# EAGLE design 32u4_devboard_v10 (EAGLE 6.6.0)
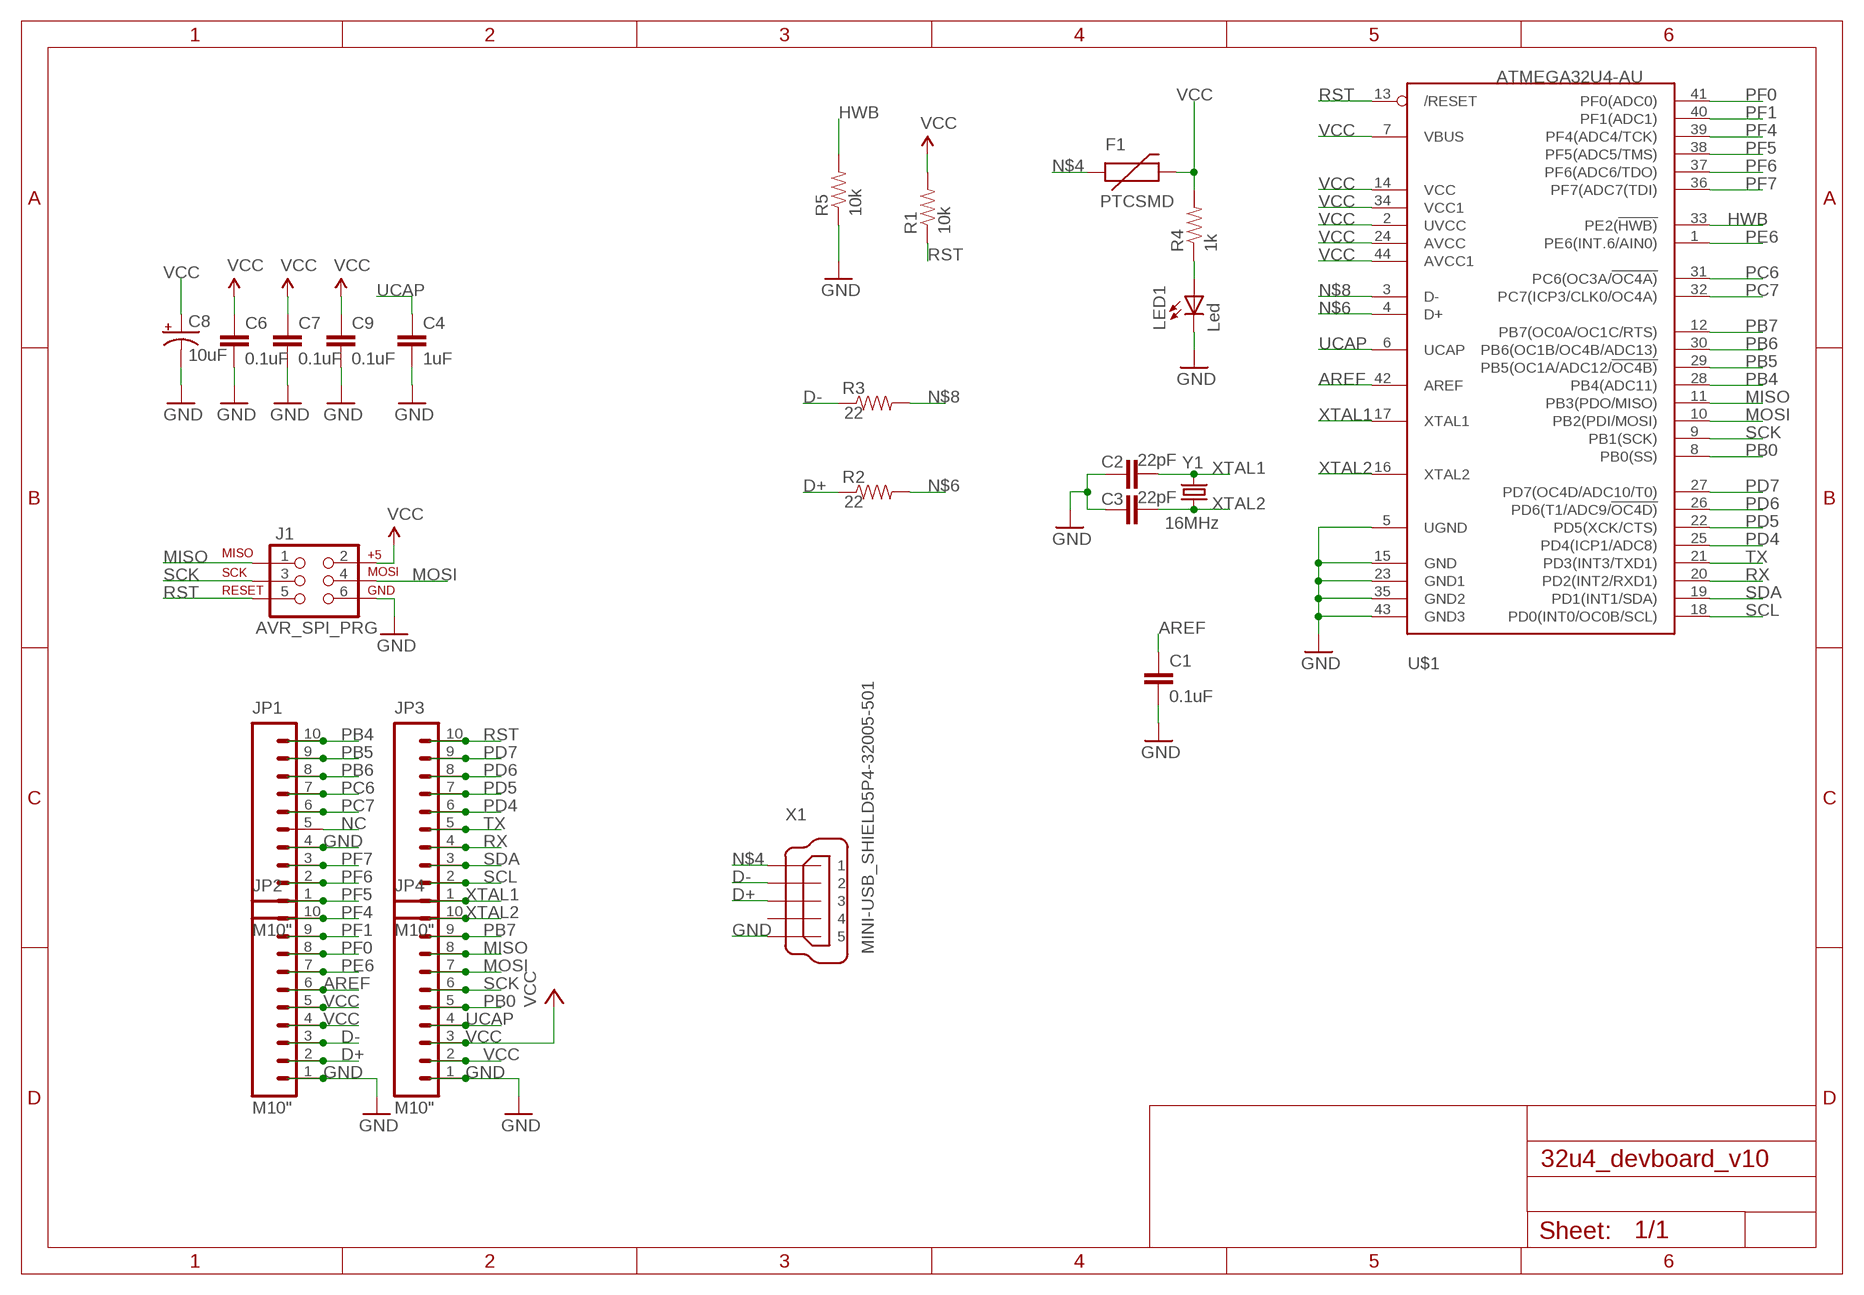
[diagram p0: schematic, sheet 1]

## Parts
C1  0.1uF  CAP0805  [0805]
C2  22pF  CAP0603-CAP  [0603-CAP]
C3  22pF  CAP0603-CAP  [0603-CAP]
C4  1uF  CAP0805  [0805]
C6  0.1uF  CAP0805  [0805]
C7  0.1uF  CAP0805  [0805]
C8  10uF  CAP_POL1206  [EIA3216]
C9  0.1uF  CAP0805  [0805]
F1  PTCSMD  [PTC-1206]
J1  AVR_SPI_PRG  AVR_SPI_PRG_6PTH  [2X3]
JP1  M10"  [1X10]
JP2  M10"  [1X10]
JP3  M10"  [1X10]
JP4  M10"  [1X10]
LED1  Led  LEDCHIP-LED0805  [CHIP-LED0805]
R1  10k  RESISTOR0805-RES  [0805]
R2  22  RESISTOR0805-RES  [0805]
R3  22  RESISTOR0805-RES  [0805]
R4  1k  RESISTOR0805-RES  [0805]
R5  10k  RESISTOR0805-RES  [0805]
U$1  ATMEGA32U4-AU  [TQFP44]
X1  MINI-USB_SHIELD5P4-32005-501  [32005-501]
Y1  16MHz  CRYSTALHC49US  [HC49US]

## Nets
AREF: C1.1 JP2.6 U$1.42(AREF)
D+: JP2.2 R2.1 X1.3
D-: JP2.3 R3.1 X1.2
GND: C1.2 C2.1 C3.1 C4.2 C6.2 C7.2 C8.C(-) C9.2 J1.6 JP1.4 JP2.1 JP4.1 LED1.C R5.1 U$1.5(UGND) U$1.15(GND) U$1.23(GND1) U$1.35(GND2) U$1.43(GND3) X1.5
HWB: R5.2 U$1.33(PE2(!HWB))
MISO: J1.1 JP4.8 U$1.11(PB3(PDO/MISO))
MOSI: J1.4 JP4.7 U$1.10(PB2(PDI/MOSI))
N$4: F1.1 X1.1
N$6: R2.2 U$1.4(D+)
N$8: R3.2 U$1.3(D-)
N$9: LED1.A R4.1
NC: JP1.5
PB0: JP4.5 U$1.8(PB0(SS))
PB4: JP1.10 U$1.28(PB4(ADC11))
PB5: JP1.9 U$1.29(PB5(OC1A/ADC12/!OC4B))
PB6: JP1.8 U$1.30(PB6(OC1B/OC4B/ADC13))
PB7: JP4.9 U$1.12(PB7(OC0A/OC1C/RTS))
PC6: JP1.7 U$1.31(PC6(OC3A/!OC4A))
PC7: JP1.6 U$1.32(PC7(ICP3/CLK0/OC4A))
PD4: JP3.6 U$1.25(PD4(ICP1/ADC8))
PD5: JP3.7 U$1.22(PD5(XCK/CTS))
PD6: JP3.8 U$1.26(PD6(T1/ADC9/!OC4D))
PD7: JP3.9 U$1.27(PD7(OC4D/ADC10/T0))
PE6: JP2.7 U$1.1(PE6(INT.6/AIN0))
PF0: JP2.8 U$1.41(PF0(ADC0))
PF1: JP2.9 U$1.40(PF1(ADC1))
PF4: JP2.10 U$1.39(PF4(ADC4/TCK))
PF5: JP1.1 U$1.38(PF5(ADC5/TMS))
PF6: JP1.2 U$1.37(PF6(ADC6/TDO))
PF7: JP1.3 U$1.36(PF7(ADC7(TDI))
RST: J1.5 JP3.10 R1.1 U$1.13(/RESET)
RX: JP3.4 U$1.20(PD2(INT2/RXD1))
SCK: J1.3 JP4.6 U$1.9(PB1(SCK))
SCL: JP3.2 U$1.18(PD0(INT0/OC0B/SCL))
SDA: JP3.3 U$1.19(PD1(INT1/SDA))
TX: JP3.5 U$1.21(PD3(INT3/TXD1))
UCAP: C4.1 JP4.4 U$1.6(UCAP)
VCC: C6.1 C7.1 C8.A(+) C9.1 F1.2 J1.2 JP2.4 JP2.5 JP4.2 JP4.3 R1.2 R4.2 U$1.2(UVCC) U$1.7(VBUS) U$1.14(VCC) U$1.24(AVCC) U$1.34(VCC1) U$1.44(AVCC1)
XTAL1: C2.2 JP3.1 U$1.17(XTAL1) Y1.2
XTAL2: C3.2 JP4.10 U$1.16(XTAL2) Y1.1
Unconnected: X1.4 X1.M1(S1) X1.M2(S2) X1.M3(S3) X1.M4(S4)

## Library data of the parts
C1-C4 C6 C7 C9 = SparkFun:CAP: Capacitor Standard 0603 ceramic capacitor, and 0.1" leaded capacitor.
C8 = SparkFun:CAP_POL: Capacitor Polarized These are standard SMD and PTH capacitors. Normally 10uF, 47uF, and 100uF in electrolytic and tantalum varieties. Always verify the external diameter of the through hole cap, it varies with capacity, voltage, and manufacturer. The EIA devices should be standard.
F1 = SparkFun:PTC: Resettable Fuse PTC Resettable Fuse. Spark Fun Electronics SKU : COM-08357
J1 = SparkFun:AVR_SPI_PRG_6: AVR ISP 6 Pin This is the reduced ISP connector for AVR programming. Common on Arduino. This footprint will take up less PCB space and can be used with a 10-pin to 6-pin adapter such as SKU: BOB-08508
JP1-JP4 = SparkFun:M10: Header 10 Standard 10-pin 0.1" header. Use with straight break away headers (SKU : PRT-00116), right angle break away headers (PRT-00553), swiss pins (PRT-00743), machine pins (PRT-00117), and female headers (PRT-00115).
LED1 = led:LED: LED OSRAM: - CHIPLED LG R971, LG N971, LY N971, LG Q971, LY Q971, LO R971, LY R971 LH N974, LH R974 LS Q976, LO Q976, LY Q976 LO Q996 - Hyper CHIPLED LW Q18S LB Q993, LB Q99A, LB R99A - SideLED LS A670, LO A670, LY A670, LG A670, LP A670 LB A673, LV A673, LT A673, LW A673 LH A674 LY A675 LS A676, LA A676, LO A676, LY A676, LW A676 LS A679, LY A679, LG A679 - Hyper Micro SIDELED® LS Y876, LA Y876, LO Y876, LY Y876 LT Y87S - SmartLED LW L88C, LW L88S LB L89C, LB L89S, LG L890 LS L89K, LO L89K, LY L89K LS L896, LA L896, LO L896, LY L896 - TOPLED LS T670, LO T670, LY T670, LG T670, LP T670 LSG T670, LSP T670, LSY T670, LOP T670, LYG T670 LG T671, LOG T671, LSG T671 LB T673, LV T673, LT T673, LW T673 LH T674 LS T676, LA T676, LO T676, LY T676, LB T676, LH T676, LSB T676, LW T676 LB T67C, LV T67C, LT T67C, LS T67K, LO T67K, LY T67K, LW E67C LS E67B, LA E67B, LO E67B, LY E67B, LB E67C, LV E67C, LT E67C LW T67C LS T679, LY T679, LG T679 LS T770, LO T770, LY T770, LG T770, LP T770 LB T773, LV T773, LT T773, LW T773 LH T774 LS E675, LA E675, LY E675, LS T675 LS T776, LA T776, LO T776, LY T776, LB T776 LHGB T686 LT T68C, LB T68C - Hyper Mini TOPLED® LB M676 - Mini TOPLED Santana® LG M470 LS M47K, LO M47K, LY M47K Source: http://www.osram.convergy.de LUXEON: - LUMILED® LXK2-PW12-R00, LXK2-PW12-S00, LXK2-PW14-U00, LXK2-PW14-V00 LXK2-PM12-R00, LXK2-PM12-S00, LXK2-PM14-U00 LXK2-PE12-Q00, LXK2-PE12-R00, LXK2-PE12-S00, LXK2-PE14-T00, LXK2-PE14-U00 LXK2-PB12-K00, LXK2-PB12-L00, LXK2-PB12-M00, LXK2-PB14-N00, LXK2-PB14-P00, LXK2-PB14-Q00 LXK2-PR12-L00, LXK2-PR12-M00, LXK2-PR14-Q00, LXK2-PR14-R00 LXK2-PD12-Q00, LXK2-PD12-R00, LXK2-PD12-S00 LXK2-PH12-R00, LXK2-PH12-S00 LXK2-PL12-P00, LXK2-PL12-Q00, LXK2-PL12-R00 Source: www.luxeon.com KINGBRIGHT: KA-3528ASYC Source: www.kingbright.com
R1-R5 = SparkFun:RESISTOR: Resistor Basic schematic elements and footprints for 0603, 1206, and PTH resistors.
U$1 = adafruit:ATMEGA32U4: http://www.ladyada.net/library/eagle
X1 = con-cypressindustries:MINI-USB_SHIELD5P4-: MINI USB-B R/A W/O POST 5 pol. Source: www.cypressindustries.com; OC_FARNELL: unknown; OC_NEWARK: unknown
Y1 = SparkFun:CRYSTAL: Crystals Various standard crystals. Proven footprints. Spark Fun Electronics SKU : COM-00534

## Board
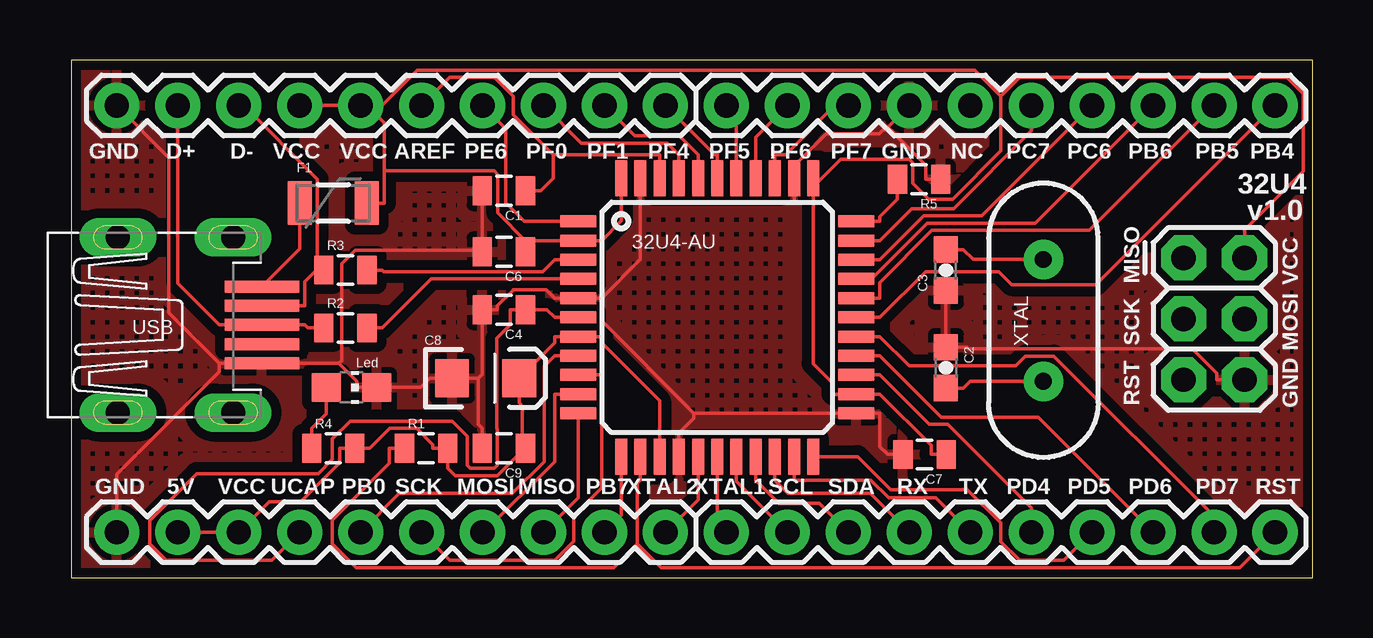
[diagram p1: board, top side]
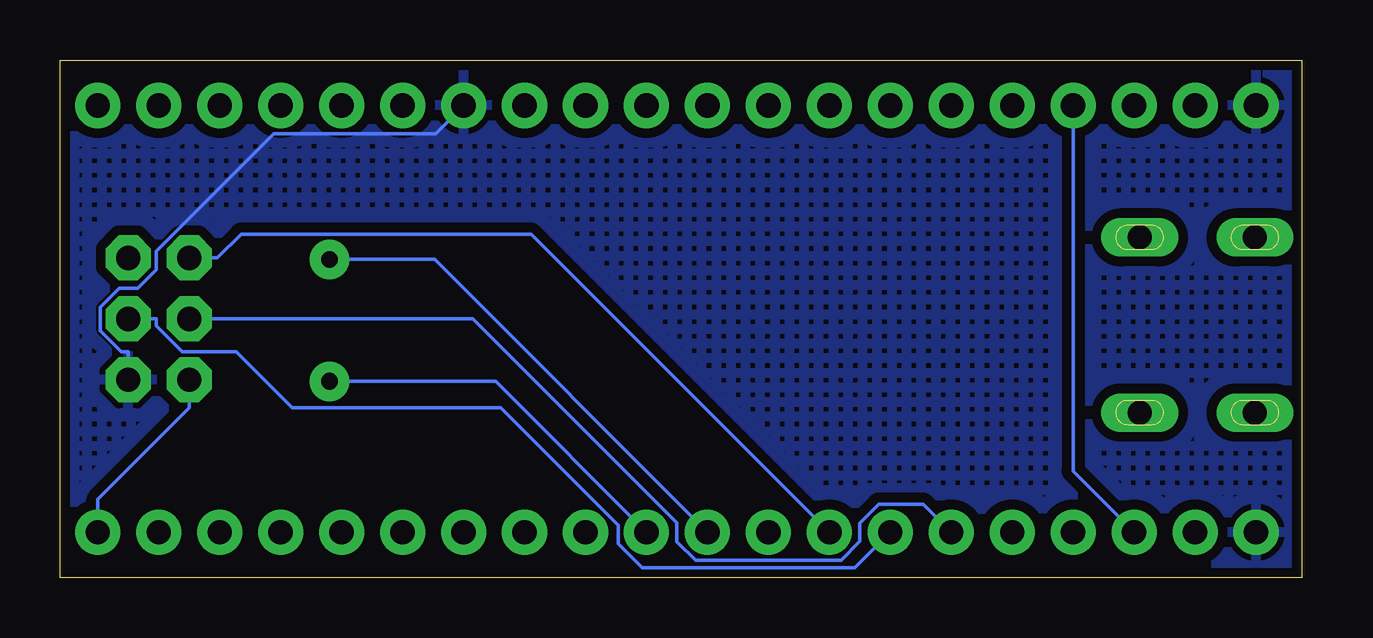
[diagram p2: board, bottom side, seen from below]

Size 51.74 x 21.58 mm. Coordinates in mm from the lower left corner, seen from the top.
Outline: 0,0 51.74,0 51.74,21.58 0,21.58 0,0
Copper layers (1*16): Top 0.035mm / dielectric 1.5mm / Bottom 0.035mm
Design rules "DFRobot_Eagle_Rule_v0.4": minimum track width 6mil, minimum drill 12mil, track to track 6mil, track to pad 6mil, pad to pad 6mil, via to via 6mil, smd to smd 0mil, copper to edge 10mil, drill to drill 10mil, minimum pad ring 12mil, minimum via ring 8mil, stop-mask expansion 2mil, vias tented up to drill 25mil, thermal gap 10mil

### Footprints (pad centres in the part's own frame; a part is rotated, then mirrored left to right if it is on the bottom)
0805 = smd 0.8 x 1.2: 1 -0.9,0; 2 0.9,0
0603-CAP = smd 1.1 x 1: 1 -0.85,0; 2 0.85,0
EIA3216 = smd 1.4 x 1.6: A 1.4,0; C -1.4,0
PTC-1206 = smd 1 x 1.8: 1 -1.4,0; 2 1.4,0
2X3 = drill 1.016 pad 1.88 octagon: 1 0,0; 2 0,2.54; 3 2.54,0; 4 2.54,2.54; 5 5.08,0; 6 5.08,2.54
1X10 = drill 1.016 pad 1.88: 1 0,0; 2 2.54,0; 3 5.08,0; 4 7.62,0; 5 10.16,0; 6 12.7,0; 7 15.24,0; 8 17.78,0; 9 20.32,0; 10 22.86,0
CHIP-LED0805 = smd 1.2 x 1.2: A 0,-1.05; C 0,1.05
TQFP44 = smd 1.5 x 0.5: 1 -5.8,4; 2 -5.8,3.2; 3 -5.8,2.4; 4 -5.8,1.6; 5 -5.8,0.8; 6 -5.8,0; 7 -5.8,-0.8; 8 -5.8,-1.6; 9 -5.8,-2.4; 10 -5.8,-3.2; 11 -5.8,-4; 23 5.8,-4; 24 5.8,-3.2; 25 5.8,-2.4; 26 5.8,-1.6; 27 5.8,-0.8; 28 5.8,0; 29 5.8,0.8; 30 5.8,1.6; 31 5.8,2.4; 32 5.8,3.2; 33 5.8,4 | smd 0.5 x 1.5: 12 -4,-5.8; 13 -3.2,-5.8; 14 -2.4,-5.8; 15 -1.6,-5.8; 16 -0.8,-5.8; 17 0,-5.8; 18 0.8,-5.8; 19 1.6,-5.8; 20 2.4,-5.8; 21 3.2,-5.8; 22 4,-5.8; 34 4,5.8; 35 3.2,5.8; 36 2.4,5.8; 37 1.6,5.8; 38 0.8,5.8; 39 0,5.8; 40 -0.8,5.8; 41 -1.6,5.8; 42 -2.4,5.8; 43 -3.2,5.8; 44 -4,5.8
32005-501 = smd 3.1 x 0.5: 1 3,1.6; 2 3,0.8; 3 3,0; 4 3,-0.8; 5 3,-1.6 | drill 1 pad 1.422 long: M1 -3,3.65; M2 -3,-3.65; M3 1.8,3.65; M4 1.8,-3.65
HC49US = drill 0.7 pad 1.651: 1 -2.54,0; 2 2.54,0

### Placement (x,y rotation side)
C1  18.03,16.13 180 top
C2  36.45,8.76 270 top
C3  36.45,12.83 90 top
C4  18.03,11.18 180 top
C6  18.03,13.59 180 top
C7  35.56,5.14 180 top
C8  17.27,8.32 0 top
C9  18.03,5.4 180 top
F1  10.92,15.62 0 top
J1  46.35,13.34 270 top
JP1  27.3,19.68 0 top
JP2  1.91,19.68 0 top
JP3  27.3,1.91 0 top
JP4  1.91,1.91 0 top
LED1  11.68,7.94 270 top
R1  14.8,5.4 0 top
R2  11.43,10.41 0 top
R3  11.43,12.83 0 top
R4  10.92,5.4 0 top
R5  35.33,16.61 180 top
U$1  26.92,10.86 0 top
X1  4.95,10.54 0 top
Y1  40.51,10.73 270 top

### Tracks (layer width: path | path; a pad name or v marks a point on that pad's centre or on a via)
AREF
  Top 0.152: 20.08,17.64 24.52,17.64 24.52,16.76 | JP2.6 15.77,20.85 17.63,20.85 18.41,20.07 18.41,19.3 20.08,17.64 | 20.08,17.64 20.08,16.65 19.56,16.13 C1.1 | U$1.42 | U$1.42 24.52,16.76 | U$1.42 24.54,16.76 24.52,16.76
D+
  Top 0.152: JP2.2 4.45,12.27 6.17,10.54 X1.3 | X1.3 | X1.3 8.08,10.54 | 8.08,10.54 9.73,10.54 9.86,10.41 R2.1 | X1.3 8.08,10.52 8.08,10.54
D-
  Top 0.152: X1.2 | X1.2 8.08,11.34 | 8.08,11.34 9.73,11.34 9.73,12.34 10.22,12.83 | 10.22,12.83 10.25,12.86 10.25,16.62 7.19,19.68 JP2.3 | R3.1 10.22,12.83 | X1.2 8.08,11.28 8.08,11.34
GND
  Top 0.152: 23.72,15.68 23.72,13.28 22.1,11.66 | 23.72,15.68 30.12,15.68 U$1.35 30.12,16.76 | U$1.43 23.72,16.61 | 23.72,16.61 23.72,15.68 | U$1.5 21.18,11.66 | 21.18,11.66 22.1,11.66 | 25.95,6.86 25.95,6.66 25.88,6.59 25.32,6.04 | 25.32,6.04 | 22.1,11.66 22.1,10.71 25.95,6.86 | 25.95,6.86 31.75,6.86 U$1.23 | U$1.5 20.64,11.66 20.14,11.66 19.8,12.01 18.43,12.01 18.4,11.97 18.36,11.93 17.76,11.33 17.76,11.18 C4.2 17.13,8.48 16.97,8.32 | U$1.5 | JP2.1 4.07,17.52 4.07,11.04 6.17,8.94 | 6.17,8.94 6.17,8.59 1.91,4.32 JP4.1 | X1.5 7.92,8.94 | 7.92,8.94 6.17,8.94 | 11.16,8.94 X1.5 | X1.5 | 16.97,8.32 16.97,6.39 17.13,6.23 C9.2 | 16.97,8.32 16.8,8.32 C8.C 14.94,8.32 14.56,7.94 LED1.C | 11.16,8.94 11.9,8.19 11.9,7.94 LED1.C | 17.13,13.66 11.84,13.66 11.27,13.09 11.27,9.05 11.16,8.94 | 17.13,13.66 C6.2 | C1.2 17.13,13.66 | LED1.C | 34.02,18.78 JP1.4 | 30.12,16.76 30.12,17.18 31.46,18.52 33.68,18.52 33.83,18.67 33.91,18.67 34.02,18.78 | 34.02,18.78 35.6,17.2 35.6,16.61 R5.1 | C7.2 34.03,5.14 33.7,5.47 33.7,6.86 U$1.23 | U$1.15 25.32,6.04 | C2.1 37.18,9.61 37.32,9.62 37.39,9.55 46.71,9.55 47.73,8.54 47.73,8.26 J1.6 | C2.1 36.45,9.75 | 36.45,9.75 C3.1 | C2.1 36.42,9.75 36.45,9.75 | 7.92,8.94 7.92,8.99 X1.5 | C3.1 36.42,12.04 C3.1 | LED1.C 12.8,7.92 LED1.C | LED1.C | U$1.15 25.3,5.03 U$1.15 | U$1.5 21.18,11.58 21.18,11.66 | U$1.23 32.77,6.86 U$1.23 | U$1.43 23.77,16.61 23.72,16.61 | U$1.35 30.18,16.76 30.12,16.76
  Bottom 0.152: J1.6 48.9,9.42 49.18,9.42 50.07,10.31 50.07,11.28 49.28,12.06 48.5,12.06 47.73,12.84 47.73,13.62 42.83,18.52 36.09,18.52 JP1.4
  pour Top (isolate 0.406, hatched): 0,21.64 51.74,21.64 51.74,-0.05 0,-0.05
  pour Bottom (isolate 0.406, hatched): 0.05,21.59 51.77,21.59 51.77,0 0.05,0
HWB
  Top 0.152: 32.77,14.86 U$1.33 32.77,14.78 32.77,14.86 | 32.77,14.86 33.7,14.86 33.7,15.05 34.43,15.78 R5.2
MISO
  Top 0.152: U$1.11 21.18,6.86 U$1.11 | U$1.11 21.12,3.34 JP4.8
  Bottom 0.152: J1.1 45.19,13.34 44.2,14.33 32.11,14.33 JP4.8
MOSI
  Top 0.152: U$1.10 20.14,7.66 20.14,4.85 17.2,1.91 JP4.7 | U$1.10 21.18,7.62 U$1.10
  Bottom 0.152: J1.4 47.73,10.79 47.73,10.51 46.64,9.42 44.4,9.42 42.07,7.09 33.38,7.09 28.47,2.19 28.47,1.42 27.48,0.43 18.62,0.43 JP4.7
N$4
  Top 0.152: 8.04,12.23 X1.1 8.08,12.19 8.04,12.23 | 8.04,12.23 9.52,13.71 F1.1
N$6
  Top 0.152: R2.2 12.96,10.41 15,12.46 20.14,12.46 U$1.4 | U$1.4 | U$1.4 21.18,12.5 U$1.4
N$8
  Top 0.152: R3.2 12.96,12.83 13.03,12.76 19.65,12.76 20.14,13.26 U$1.3 | U$1.3 | U$1.3 21.18,13.26 U$1.3 | U$1.3
N$9
  Top 0.152: R4.1 10.02,6.23 10.63,6.84 10.63,7.92 | 10.63,7.92 LED1.A 10.67,7.92 10.63,7.92
PB0
  Top 0.152: U$1.8 | U$1.8 20.14,9.26 19.71,8.82 19.71,4.85 18.39,3.52 13.68,3.52 JP4.5 | U$1.8 21.18,9.3 U$1.8
PB4
  Top 0.152: U$1.28 | U$1.28 32.77,10.86 | 32.77,10.86 33.7,10.86 35.6,12.76 38.65,12.76 39.19,12.22 42.7,12.22 JP1.10 | U$1.28 32.77,10.82 32.77,10.86
PB5
  Top 0.152: JP1.9 42.42,14.48 35.87,14.48 33.7,12.31 33.7,11.66 32.77,11.66 | U$1.29 | U$1.29 32.77,11.66 | U$1.29 32.77,11.58 32.77,11.66
PB6
  Top 0.152: U$1.30 | U$1.30 32.77,12.46 | 32.77,12.46 33.35,12.46 35.68,14.78 40.18,14.78 JP1.8 | U$1.30 32.77,12.5 32.77,12.46
PB7
  Top 0.152: 22.92,5.03 U$1.12 22.86,5.03 22.92,5.03 | 22.92,5.03 22.92,2.6 JP4.9
PC6
  Top 0.152: JP1.7 37.95,15.09 35.53,15.09 33.7,13.26 32.77,13.26 | U$1.31 | U$1.31 32.77,13.26 | U$1.31 32.77,13.26
PC7
  Top 0.152: U$1.32 32.77,14.06 | 32.77,14.06 33.7,14.06 35.04,15.39 36.77,15.39 40.01,18.63 JP1.6 | U$1.32 32.77,14.02 32.77,14.06
PD4
  Top 0.152: U$1.25 | U$1.25 32.77,8.46 | 32.77,8.46 33.7,8.46 35.77,6.39 36.54,6.39 40.01,2.92 JP3.6 | U$1.25 32.77,8.53 32.77,8.46
PD5
  Top 0.152: 30.94,5.06 U$1.22 30.94,5.03 30.94,5.06 | 30.94,5.06 32.77,5.06 34.15,3.68 37.34,3.68 38.73,2.29 38.73,1.51 39.52,0.73 41.37,0.73 JP3.7
PD6
  Top 0.152: JP3.8 40.29,6.7 36.26,6.7 33.7,9.26 32.77,9.26 | U$1.26 | U$1.26 32.77,9.26 | U$1.26 32.77,9.3 32.77,9.26
PD7
  Top 0.152: U$1.27 | U$1.27 32.77,10.06 | 32.77,10.06 33.7,10.06 34.93,8.83 39.35,8.83 39.76,9.25 40.95,9.25 47.62,2.57 JP3.9 | U$1.27 32.77,10.06
PE6
  Top 0.152: 21.03,14.86 U$1.1 21.03,14.78 21.03,14.86 | 21.03,14.86 18.88,14.86 18.11,15.63 18.11,18.72 JP2.7
PF0
  Top 0.152: U$1.41 | U$1.41 25.32,16.76 | 25.32,16.76 25.32,17.64 24.84,18.12 21.25,18.12 JP2.8 | U$1.41 25.3,16.76 25.32,16.76
PF1
  Top 0.152: U$1.40 | U$1.40 26.12,16.76 | 26.12,16.76 26.12,17.64 25.34,18.43 23.48,18.43 JP2.9 | U$1.40 26.06,16.76 26.12,16.76
PF4
  Top 0.152: U$1.39 | U$1.39 26.92,16.76 | 26.92,16.76 26.92,17.64 26.81,17.64 JP2.10 | U$1.39 26.98,16.76 26.92,16.76
PF5
  Top 0.152: U$1.38 | U$1.38 27.72,16.76 | 27.72,16.76 27.72,19.27 JP1.1 | U$1.38 27.74,16.76 27.72,16.76
PF6
  Top 0.152: U$1.37 | U$1.37 28.52,16.76 | 28.52,16.76 28.52,18.36 JP1.2 | U$1.37 28.5,16.76 28.52,16.76
PF7
  Top 0.152: U$1.36 | U$1.36 29.32,16.76 | 29.32,16.76 29.32,17.64 29.78,17.64 31.82,19.68 JP1.3 | U$1.36 29.26,16.76 29.32,16.76
RST
  Top 0.152: 23.72,5.03 U$1.13 23.77,5.03 23.72,5.03 | 23.72,5.03 23.72,4.08 23.59,3.95 23.59,1.42 | R1.1 13.27,5.4 13.27,4.77 10.89,2.39 10.89,1.43 11.89,0.43 22.6,0.43 23.59,1.42 | 23.59,1.42 24.59,0.43 48.69,0.43 JP3.10
  Bottom 0.152: J1.5 46.35,7.09 50.16,3.28 JP3.10
RX
  Top 0.152: U$1.20 | U$1.20 29.32,5.03 | 29.32,5.03 29.32,4.08 29.87,3.53 33.3,3.53 JP3.4 | U$1.20 29.26,5.03 29.32,5.03
SCK
  Top 0.152: 21.18,8.46 U$1.9 21.18,8.53 21.18,8.46 | 21.18,8.46 22.1,8.46 22.1,3.75 20.95,2.6 20.95,1.52 20.16,0.73 15.78,0.73 JP4.6
  Bottom 0.152: JP4.6 15.77,3.07 17.63,3.07 18.41,2.29 18.41,1.52 19.2,0.74 25.25,0.74 26.04,1.52 26.04,2.29 34.54,10.79 J1.3
SCL
  Top 0.152: U$1.18 | U$1.18 27.72,5.03 | 27.72,5.03 27.72,4.03 JP3.2 | U$1.18 27.74,5.03 27.72,5.03
SDA
  Top 0.152: U$1.19 | U$1.19 28.52,5.03 | 28.52,5.03 28.52,4.08 29.49,3.12 31.17,3.12 JP3.3 | U$1.19 28.5,5.03 28.52,5.03
TX
  Top 0.152: JP3.5 36.04,3.33 34.06,3.33 33.32,4.08 30.12,4.08 30.12,5.03 | 30.12,5.03 U$1.21 30.18,5.03 30.12,5.03
UCAP
  Top 0.152: JP4.4 8.36,0.73 3.96,0.73 3.27,1.42 3.27,2.39 5.23,4.35 10.3,4.35 10.89,4.94 10.89,5.8 11.62,6.53 15.89,6.53 16.5,5.91 16.5,4.7 16.64,4.57 17.64,4.57 17.76,4.7 17.76,6.21 17.74,6.23 17.74,9.98 18.3,10.55 18.3,11.18 C4.1 19.83,11.18 20.14,10.86 U$1.6 | U$1.6 | U$1.6 21.18,10.82 U$1.6
VCC
  Top 0.152: 18.81,5.4 18.81,7.16 18.67,7.29 C8.A 20.14,9.79 20.14,10.06 U$1.7 | 18.81,5.4 18.81,5.31 17.76,4.26 16,4.26 15.7,4.57 R1.2 15.07,5.4 15.07,5.55 14.39,6.23 13.28,6.23 12.45,5.4 R4.2 11.19,5.4 11.19,4.81 9.56,3.17 8.26,3.17 JP4.3 JP4.2 | 18.81,5.4 C9.1 | U$1.14 24.52,7.38 24.48,7.42 22.1,9.8 22.1,10.06 U$1.7 | 12.65,19.38 13.05,18.98 13.05,16.96 | 12.65,19.38 12.34,19.68 JP2.5 JP2.4 | 38.73,20.07 37.64,21.16 14.43,21.16 12.65,19.38 | U$1.2 22.1,14.06 22.92,14.88 22.92,16.61 | U$1.44 22.92,16.61 | U$1.7 | 18.93,14.06 17.78,15.21 17.78,16.8 17.63,16.96 13.05,16.96 | C6.1 18.93,14.06 | 18.93,14.06 20.14,14.06 U$1.2 | 13.05,16.96 13.05,15.62 F1.2 | 38.73,20.07 38.73,17.79 36.73,15.78 35.73,15.78 35.07,16.45 35.07,17.3 34.92,17.45 32.07,17.45 30.92,16.3 | 38.73,20.07 39.52,20.86 50.65,20.86 51.34,20.16 51.34,16.95 48.9,14.5 J1.2 | 30.92,16.3 30.92,15.68 30.92,8.93 31.75,8.11 31.75,7.66 U$1.24 | U$1.34 30.92,16.61 | 30.92,16.61 30.92,16.3 | U$1.24 33.7,7.66 35.83,5.53 35.83,5.14 C7.1 | U$1.14 24.54,5.03 U$1.14 | U$1.2 21.18,14.02 U$1.2 | U$1.7 21.18,10.06 U$1.7 | U$1.7 | U$1.44 22.86,16.61 22.92,16.61 | U$1.24 32.77,7.62 U$1.24 | U$1.34 30.94,16.61 30.92,16.61
  Bottom 0.152: JP2.4 9.53,4.45 JP4.3
XTAL1
  Top 0.152: C2.2 37.18,7.91 37.46,8.19 Y1.2 | JP3.1 26.92,2.29 26.92,5.03 | 26.92,5.03 U$1.17 | U$1.17 | C2.2 36.42,7.92 C2.2 | 26.92,5.03 26.98,5.03 U$1.17
  Bottom 0.152: JP3.1 33.59,8.19 Y1.2
XTAL2
  Top 0.152: C3.2 37.18,13.68 37.58,13.27 Y1.1 | JP4.10 26.12,3.26 26.12,5.03 | 26.12,5.03 U$1.16 | U$1.16 | C3.2 36.42,13.72 C3.2 | 26.12,5.03 26.06,5.03 U$1.16
  Bottom 0.152: JP4.10 36.13,13.27 Y1.1

### Text on the board
tPlace: GND | D+ | D- | VCC | VCC | AREF | PE6 | PF0 | PF1 | PF4 | PF5 | PF6 | PF7 | GND | NC | PC7 | PC6 | PB6 | PB5 | PB4 | 32U4 | v1.0 | 32U4-AU | MISO | VCC | SCK | MOSI | USB | XTAL | RST | GND | GND | 5V | VCC | UCAP | PB0 | SCK | MOSI | MISO | PB7 | XTAL2 | XTAL1 | SCL | SDA | RX | TX | PD4 | PD5 | PD6 | PD7 | RST